# Altium project IGresupply.PrjPCB
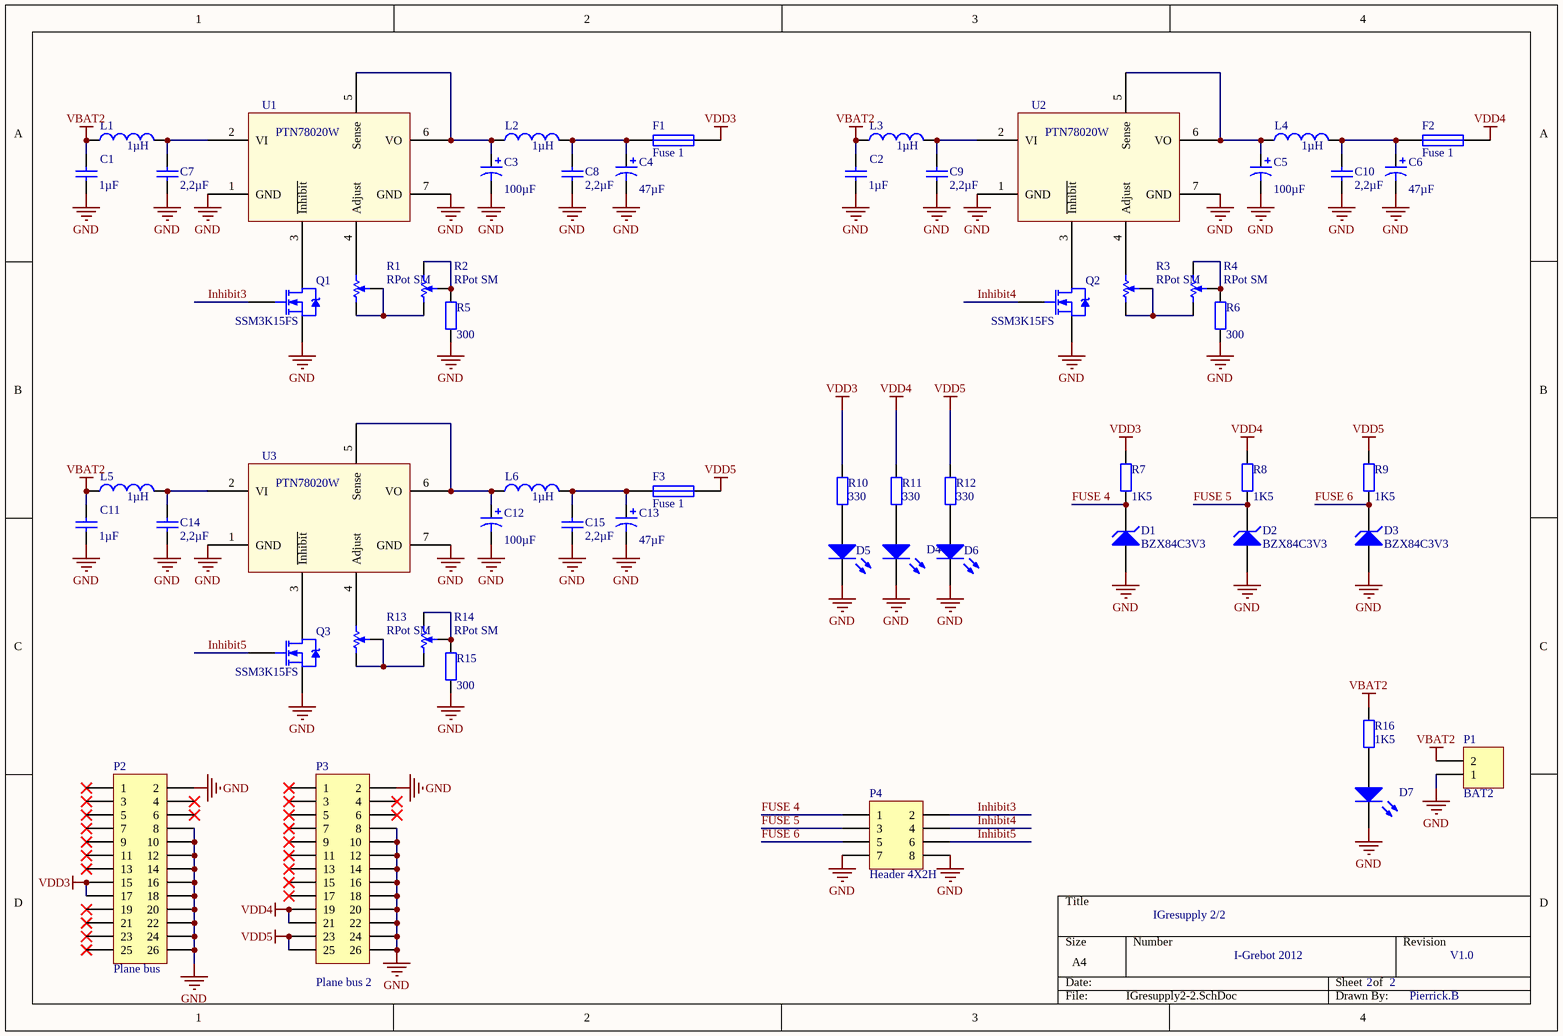
[diagram p0: IGresupply2-2.SchDoc]
2 sheets, 151 parts. Net scope: global (net labels, ports and power ports of the same name join across sheets).
Board file: IGresupply.PcbDoc
Sheets:
  IGresupply2-2.SchDoc
  IGresupply1-2.SchDoc

## Sheet IGresupply2-2.SchDoc
size A4

### Parts
C1  value 1µF  [Boitier tantale A]  (hidden comment: Cap)
C2  value 1µF  [Boitier tantale A]  (hidden comment: Cap)
C3  value 100µF  [Boitier tantale C]  (hidden comment: Cap Pol)
C4  value 47µF  [Boitier tantale C]  (hidden comment: Cap Pol)
C5  value 100µF  [Boitier tantale C]  (hidden comment: Cap Pol)
C6  value 47µF  [Boitier tantale C]  (hidden comment: Cap Pol)
C7  value 2,2µF  [Boitier tantale A]  (hidden comment: Cap)
C8  value 2,2µF  [Boitier tantale A]  (hidden comment: Cap)
C9  value 2,2µF  [Boitier tantale A]  (hidden comment: Cap)
C10  value 2,2µF  [Boitier tantale A]  (hidden comment: Cap)
C11  value 1µF  [Boitier tantale A]  (hidden comment: Cap)
C12  value 100µF  [Boitier tantale C]  (hidden comment: Cap Pol)
C13  value 47µF  [Boitier tantale C]  (hidden comment: Cap Pol)
C14  value 2,2µF  [Boitier tantale A]  (hidden comment: Cap)
C15  value 2,2µF  [Boitier tantale A]  (hidden comment: Cap)
D1  BZX84C3V3  [SOT-23]
D2  BZX84C3V3  [SOT-23]
D3  BZX84C3V3  [SOT-23]
D4  LED1  [HSMS-C110]  (value not drawn)
D5  LED1  [HSMS-C110]  (value not drawn)
D6  LED1  [HSMS-C110]  (value not drawn)
D7  LED1  [HSMS-C110]  (value not drawn)
F1  Fuse 1  [MCCQ-122]
F2  Fuse 1  [MCCQ-122]
F3  Fuse 1  [MCCQ-122]
L1  value 1µH  [744772010]  (hidden comment: Inductor)
L2  value 1µH  [744772010]  (hidden comment: Inductor)
L3  value 1µH  [744772010]  (hidden comment: Inductor)
L4  value 1µH  [744772010]  (hidden comment: Inductor)
L5  value 1µH  [744772010]  (hidden comment: Inductor)
L6  value 1µH  [744772010]  (hidden comment: Inductor)
P1  BAT2  [SL 5.08/90]
P2  Plane bus  [HDR2X13H]
P3  Plane bus 2  [HDR2X13H]
P4  Header 4X2H  [HDR2X4H]
Q1  SSM3K15FS  [SOT-23]
Q2  SSM3K15FS  [SOT-23]
Q3  SSM3K15FS  [SOT-23]
R1  RPot SM  [3296X]
R2  RPot SM  [3296X]
R3  RPot SM  [3296X]
R4  RPot SM  [3296X]
R5  value 300  [0805]  (hidden comment: Res2)
R6  value 300  [0805]  (hidden comment: Res2)
R7  value 1K5  [0805]  (hidden comment: Res2)
R8  value 1K5  [0805]  (hidden comment: Res2)
R9  value 1K5  [0805]  (hidden comment: Res2)
R10  value 330  [0805]  (hidden comment: Res2)
R11  value 330  [0805]  (hidden comment: Res2)
R12  value 330  [0805]  (hidden comment: Res2)
R13  RPot SM  [3296X]
R14  RPot SM  [3296X]
R15  value 300  [0805]  (hidden comment: Res2)
R16  value 1K5  [0805]  (hidden comment: Res2)
U1  PTN78020W  [EUK]
U2  PTN78020W  [EUK]
U3  PTN78020W  [EUK]

### Nets
GND: C1.1 C2.1 C3.2 C4.2 C5.2 C6.2 C7.1 C8.1 C9.1 C10.1 C11.1 C12.2 C13.2 C14.1 C15.1 D1.1(A) D2.1(A) D3.1(A) D4.2(K) D5.2(K) D6.2(K) D7.2(K) P1.1 P2.2 P2.8 P2.10 P2.12 P2.14 P2.16 P2.18 P2.20 P2.22 P2.24 P2.26 P3.2 P3.8 P3.10 P3.12 P3.14 P3.16 P3.18 P3.20 P3.22 P3.24 P3.26 P4.7 P4.8 Q1.3(S) Q2.3(S) Q3.3(S) R5.1 R6.1 R15.1 U1.1(GND) U1.7(GND) U2.1(GND) U2.7(GND) U3.1(GND) U3.7(GND)
VBAT2: C1.2 C2.2 C11.2 L1.1 L3.1 L5.1 P1.2 R16.2
VDD3: F1.2 P2.15 P2.17 R7.2 R10.2
VDD4: F2.2 P3.19 P3.21 R8.2 R11.2
VDD5: F3.2 P3.23 P3.25 R9.2 R12.2
FUSE 4: D1.3(K) P4.1 R7.1
FUSE 5: D2.3(K) P4.3 R8.1
FUSE 6: D3.3(K) P4.5 R9.1
Inhibit3: P4.2 Q1.1(G)
Inhibit4: P4.4 Q2.1(G)
Inhibit5: P4.6 Q3.1(G)
NetC3_1: C3.1 L2.1 U1.5(Sense) U1.6(VO)
NetC4_1: C4.1 C8.2 F1.1 L2.2
NetC5_1: C5.1 L4.1 U2.5(Sense) U2.6(VO)
NetC6_1: C6.1 C10.2 F2.1 L4.2
NetC7_2: C7.2 L1.2 U1.2(VI)
NetC9_2: C9.2 L3.2 U2.2(VI)
NetC12_1: C12.1 L6.1 U3.5(Sense) U3.6(VO)
NetC13_1: C13.1 C15.2 F3.1 L6.2
NetC14_2: C14.2 L5.2 U3.2(VI)
NetD4_1: D4.1(A) R11.1
NetD5_1: D5.1(A) R10.1
NetD6_1: D6.1(A) R12.1
NetD7_1: D7.1(A) R16.1
NetQ1_2: Q1.2(D) U1.3(~{Inhibit})
NetQ2_2: Q2.2(D) U2.3(~{Inhibit})
NetQ3_2: Q3.2(D) U3.3(~{Inhibit})
NetR1_1: R1.1(-) R1.2(W) R2.1(-)
NetR1_3: R1.3(+) U1.4(Adjust)
NetR2_2: R2.2(W) R2.3(+) R5.2
NetR3_1: R3.1(-) R3.2(W) R4.1(-)
NetR3_3: R3.3(+) U2.4(Adjust)
NetR4_2: R4.2(W) R4.3(+) R6.2
NetR13_1: R13.1(-) R13.2(W) R14.1(-)
NetR13_3: R13.3(+) U3.4(Adjust)
NetR14_2: R14.2(W) R14.3(+) R15.2

Not connected (* = marked no-connect by the designer): P2 1* 3* 4* 5* 6* 7* 9* 11* 13* 19* 21* 23* 25*; P3 1* 3* 4* 5* 6* 7* 9* 11* 13* 15* 17*

### Notes on the sheet
- IGresupply 2/2
- I-Grebot 2012
- 2
- V1.0
- Pierrick.B

### Library data of the parts
C1 C2 C7-C11 C14 C15 = Cap: Capacitor; Published: 8-Jun-2000; LatestRevisionDate: 17-Jul-2002; LatestRevisionNote: Re-released for DXP Platform.; PackageReference: RAD-0.3; Publisher: Altium Limited; Supplier: FARNELL
C3-C6 C12 C13 = Cap Pol: Polarized Capacitor; Published: 8-Jun-2000; LatestRevisionDate: 17-Jul-2002; LatestRevisionNote: Re-released for DXP Platform.; PackageReference: POLAR0.8; Publisher: Altium Limited; Supplier: FARNELL
D1-D3 = D Zener: Zener Diode; Published: 8-Jun-2000; LatestRevisionDate: 17-Jul-2002; LatestRevisionNote: Re-released for DXP Platform.; PackageReference: DIODE-0.7; Publisher: Altium Limited
D4-D7 = LED1: Typical RED GaAs LED; Published: 8-Jun-2000; LatestRevisionDate: 08-Jul-2005; LatestRevisionNote: Mech Layer 1 removed.; PackageReference: LED-1; Publisher: Altium Limited
F1-F3 = Fuse 1: Fuse; Published: 8-Jun-2000; LatestRevisionDate: 17-Jul-2002; LatestRevisionNote: Re-released for DXP Platform.; PackageReference: PIN-W2/E2.8; Publisher: Altium Limited
L1-L6 = Inductor: Code_IEC: 1005; Published: 8-Jun-2000; LatestRevisionDate: 17-Jul-2002; LatestRevisionNote: Re-released for DXP Platform.; PackageReference: 0402-A; Publisher: Altium Limited; Code_JEITA: 0402
P1 = 0436500203: Micro-Fit, 3.0; LatestRevisionDate: 17-Jul-2002; LatestRevisionNote: Re-released for DXP Platform.; Publisher: Altium Limited
P2 P3 = Header 13X2H: Header, 13-Pin, Dual row, Right Angle; LatestRevisionDate: 17-Jul-2002; LatestRevisionNote: Re-released for DXP Platform.; Publisher: Altium Limited
P4 = Header 4X2H: Header, 4-Pin, Dual row, Right Angle; LatestRevisionDate: 17-Jul-2002; LatestRevisionNote: Re-released for DXP Platform.; Publisher: Altium Limited
Q1-Q3 = NMOS-2: N-Channel Power MOSFET; Note: Pin 2 is electrically connected to pin 4.; Published: 8-Jun-2000; LatestRevisionDate: 17-Jul-2002; LatestRevisionNote: Re-released for DXP Platform.; DatasheetDocument: PD-9.814; PackageReference: TO-220AB; Publisher: Altium Limited; Code_JEDEC: TO-220-AB; ComponentLink1Description: Manufacturer Link; ComponentLink1URL: http://www.irf.com/
R1-R4 R13 R14 = RPot SM: Square Trimming Potentiometer; Published: 17-Dec-2003; DatasheetDocument: Oct-2003; PackageReference: POT4MM-2; Publisher: Altium Limited; ComponentLink1Description: Manufacturer Link; ComponentLink1URL: http://bourns.com/2/search.html
R5-R12 R15 R16 = Res2: Resistor; Published: 8-Jun-2000; LatestRevisionDate: 17-Jul-2002; LatestRevisionNote: Re-released for DXP Platform.; PackageReference: AXIAL-0.4; Publisher: Altium Limited
  R5-R9 R15: Supplier: FARNELL

## Sheet IGresupply1-2.SchDoc
size A3
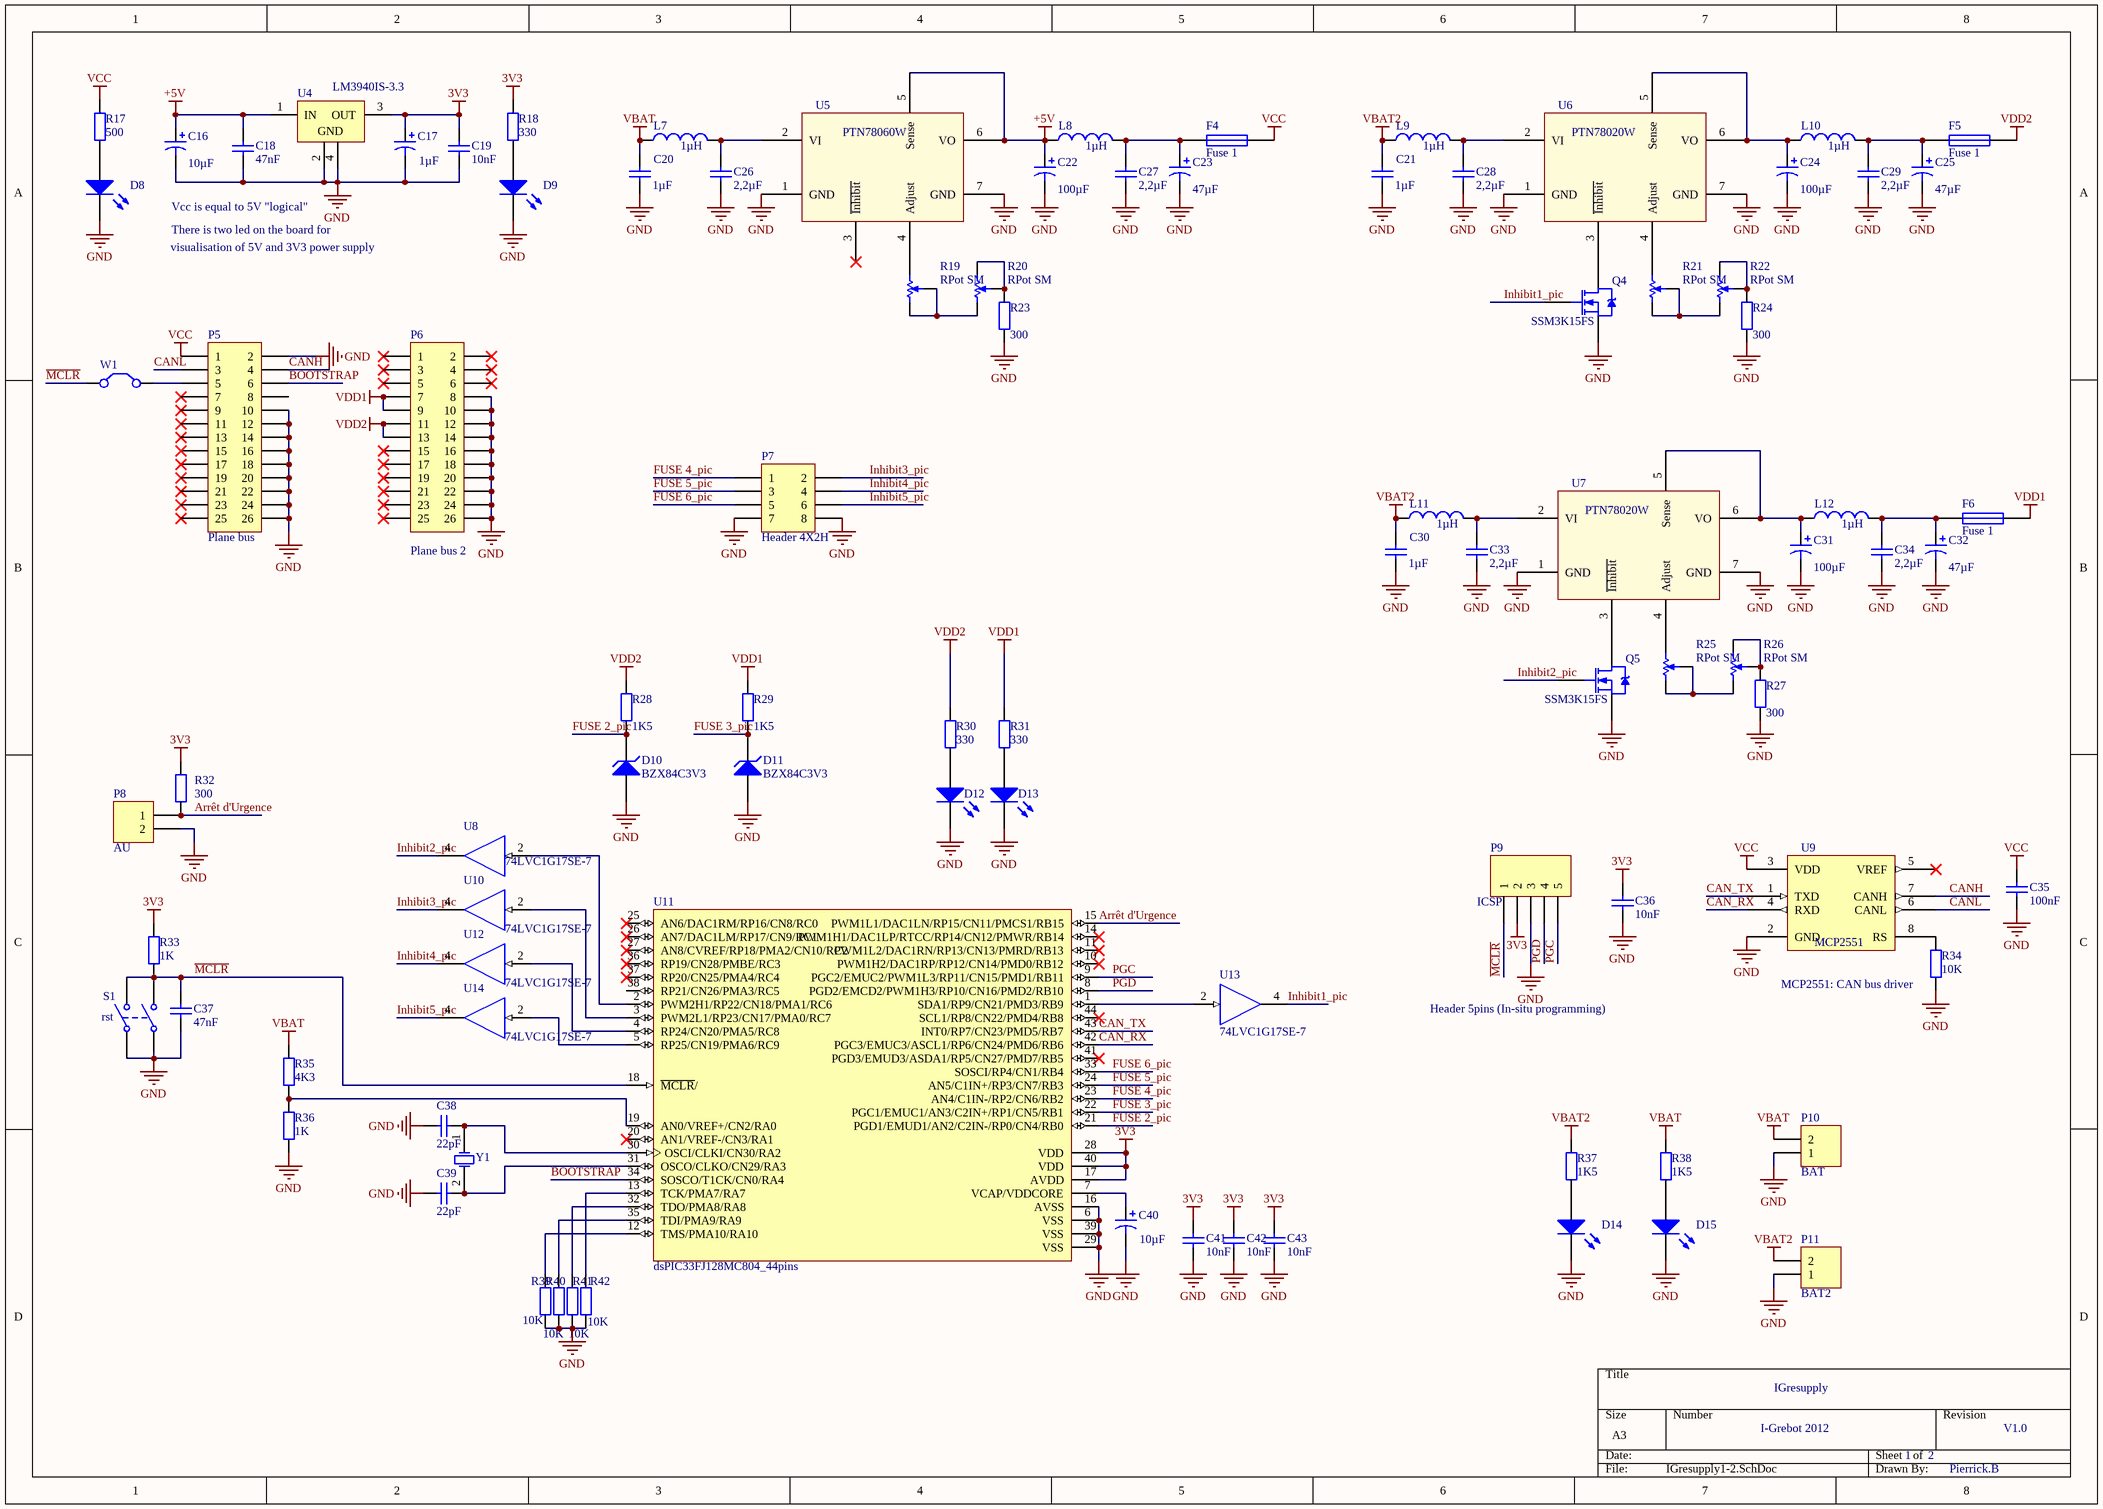
[diagram p1: IGresupply1-2.SchDoc]

### Parts
C16  value 10µF  [Boitier tantale A]  (hidden comment: Cap Pol)
C17  value 1µF  [Boitier tantale A]  (hidden comment: Cap Pol)
C18  value 47nF  [C0603]  (hidden comment: Cap)
C19  value 10nF  [C0603]  (hidden comment: Cap)
C20  value 1µF  [Boitier tantale A]  (hidden comment: Cap)
C21  value 1µF  [Boitier tantale A]  (hidden comment: Cap)
C22  value 100µF  [Boitier tantale C]  (hidden comment: Cap Pol)
C23  value 47µF  [Boitier tantale C]  (hidden comment: Cap Pol)
C24  value 100µF  [Boitier tantale C]  (hidden comment: Cap Pol)
C25  value 47µF  [Boitier tantale C]  (hidden comment: Cap Pol)
C26  value 2,2µF  [Boitier tantale A]  (hidden comment: Cap)
C27  value 2,2µF  [Boitier tantale A]  (hidden comment: Cap)
C28  value 2,2µF  [Boitier tantale A]  (hidden comment: Cap)
C29  value 2,2µF  [Boitier tantale A]  (hidden comment: Cap)
C30  value 1µF  [Boitier tantale A]  (hidden comment: Cap)
C31  value 100µF  [Boitier tantale C]  (hidden comment: Cap Pol)
C32  value 47µF  [Boitier tantale C]  (hidden comment: Cap Pol)
C33  value 2,2µF  [Boitier tantale A]  (hidden comment: Cap)
C34  value 2,2µF  [Boitier tantale A]  (hidden comment: Cap)
C35  value 100nF  [C0603]  (hidden comment: Cap)
C36  value 10nF  [C0603]  (hidden comment: Cap)
C37  value 47nF  [C0603]  (hidden comment: Cap)
C38  value 22pF  [C0603]  (hidden comment: Cap)
C39  value 22pF  [C0603]  (hidden comment: Cap)
C40  value 10µF  [Boitier tantale A]  (hidden comment: Cap Pol)
C41  value 10nF  [C0603]  (hidden comment: Cap)
C42  value 10nF  [C0603]  (hidden comment: Cap)
C43  value 10nF  [C0603]  (hidden comment: Cap)
D8  LED1  [HSMS-C110]  (value not drawn)
D9  LED1  [HSMS-C110]  (value not drawn)
D10  BZX84C3V3  [SOT-23]
D11  BZX84C3V3  [SOT-23]
D12  LED1  [HSMS-C110]  (value not drawn)
D13  LED1  [HSMS-C110]  (value not drawn)
D14  LED1  [HSMS-C110]  (value not drawn)
D15  LED1  [HSMS-C110]  (value not drawn)
F4  Fuse 1  [MCCQ-122]
F5  Fuse 1  [MCCQ-122]
F6  Fuse 1  [MCCQ-122]
L7  value 1µH  [744772010]  (hidden comment: Inductor)
L8  value 1µH  [744772010]  (hidden comment: Inductor)
L9  value 1µH  [744772010]  (hidden comment: Inductor)
L10  value 1µH  [744772010]  (hidden comment: Inductor)
L11  value 1µH  [744772010]  (hidden comment: Inductor)
L12  value 1µH  [744772010]  (hidden comment: Inductor)
P5  Plane bus  [HDR2X13H]
P6  Plane bus 2  [HDR2X13H]
P7  Header 4X2H  [HDR2X4H]
P8  AU  [SL 5.08/90]
P9  ICSP  [HDR1X5]
P10  BAT  [SL 5.08/90]
P11  BAT2  [SL 5.08/90]
Q4  SSM3K15FS  [SOT-23]
Q5  SSM3K15FS  [SOT-23]
R17  value 500  [0805]  (hidden comment: Res2)
R18  value 330  [0805]  (hidden comment: Res2)
R19  RPot SM  [3296X]
R20  RPot SM  [3296X]
R21  RPot SM  [3296X]
R22  RPot SM  [3296X]
R23  value 300  [0805]  (hidden comment: Res2)
R24  value 300  [0805]  (hidden comment: Res2)
R25  RPot SM  [3296X]
R26  RPot SM  [3296X]
R27  value 300  [0805]  (hidden comment: Res2)
R28  value 1K5  [0805]  (hidden comment: Res2)
R29  value 1K5  [0805]  (hidden comment: Res2)
R30  value 330  [0805]  (hidden comment: Res2)
R31  value 330  [0805]  (hidden comment: Res2)
R32  value 300  [0603]  (hidden comment: Res2)
R33  value 1K  [0603]  (hidden comment: Res2)
R34  value 10K  [0805]  (hidden comment: Res2)
R35  value 4K3  [0603]  (hidden comment: Res2)
R36  value 1K  [0603]  (hidden comment: Res2)
R37  value 1K5  [0805]  (hidden comment: Res2)
R38  value 1K5  [0805]  (hidden comment: Res2)
R39  value 10K  [0603]  (hidden comment: Res2)
R40  value 10K  [0603]  (hidden comment: Res2)
R41  value 10K  [0603]  (hidden comment: Res2)
R42  value 10K  [0603]  (hidden comment: Res2)
S1  rst  [Bouton poussoir]
U4  LM3940IS-3.3  [SOT223]
U5  PTN78060W  [EUW]
U6  PTN78020W  [EUK]
U7  PTN78020W  [EUK]
U8  74LVC1G17SE-7  [DBV]
U9  MCP2551  [SOIC150-8]
U10  74LVC1G17SE-7  [DBV]
U11  dsPIC33FJ128MC804_44pins  [TQFP-44]
U12  74LVC1G17SE-7  [DBV]
U13  74LVC1G17SE-7  [DBV]
U14  74LVC1G17SE-7  [DBV]
W1  Jumper  [HDR1X2]  (value not drawn)
Y1  XTAL  [HC49US]  (value not drawn)

### Nets
3V3: C17.1 C19.2 C36.2 C41.2 C42.2 C43.2 P9.2 R18.2 R32.2 R33.2 U4.3(OUT) U11.17(AVDD) U11.28(VDD) U11.40(VDD)
+5V: C16.1 C18.2 C22.1 L8.1 U4.1(IN) U5.5(Sense) U5.6(VO) U8.5(+5V) U10.5(+5V) U12.5(+5V) U13.5(+5V) U14.5(+5V)
GND: C16.2 C17.2 C18.1 C19.1 C20.1 C21.1 C22.2 C23.2 C24.2 C25.2 C26.1 C27.1 C28.1 C29.1 C30.1 C31.2 C32.2 C33.1 C34.1 C35.1 C36.1 C37.1 C38.1 C39.1 C40.2 C41.1 C42.1 C43.1 D8.2(K) D9.2(K) D10.1(A) D11.1(A) D12.2(K) D13.2(K) D14.2(K) D15.2(K) P5.2 P5.10 P5.12 P5.14 P5.16 P5.18 P5.20 P5.22 P5.24 P5.26 P6.8 P6.10 P6.12 P6.14 P6.16 P6.18 P6.20 P6.22 P6.24 P6.26 P7.7 P7.8 P8.2 P9.3 P10.1 P11.1 Q4.3(S) Q5.3(S) R23.1 R24.1 R27.1 R34.1 R36.1 R39.1 R40.1 R41.1 R42.1 S1.1(COMMON1) S1.3(COMMON2) U4.2(GND) U4.4(GND) U5.1(GND) U5.7(GND) U6.1(GND) U6.7(GND) U7.1(GND) U7.7(GND) U8.3(GND) U9.2(GND) U10.3(GND) U11.6(VSS) U11.16(AVSS) U11.29(VSS) U11.39(VSS) U12.3(GND) U13.3(GND) U14.3(GND)
VBAT: C20.2 L7.1 P10.2 R35.2 R38.2
VBAT2: C21.2 C30.2 L9.1 L11.1 P11.2 R37.2
VCC: C35.2 F4.2 P5.1 R17.2 U9.3(VDD)
VDD1: F6.2 P6.7 P6.9 R29.2 R31.2
VDD2: F5.2 P6.11 P6.13 R28.2 R30.2
Arrêt d'Urgence: P8.1 R32.1 U11.15(PWM1L1/DAC1LN/RP15/CN11/PMCS1/RB15)
BOOTSTRAP: P5.6 U11.34(SOSCO/T1CK/CN0/RA4)
CAN_RX: U9.4(RXD) U11.42(PGC3/EMUC3/ASCL1/RP6/CN24/PMD6/RB6)
CAN_TX: U9.1(TXD) U11.43(INT0/RP7/CN23/PMD5/RB7)
CANH: P5.4 U9.7(CANH)
CANL: P5.3 U9.6(CANL)
FUSE 2_pic: D10.3(K) R28.1 U11.21(PGD1/EMUD1/AN2/C2IN-/RP0/CN4/RB0)
FUSE 3_pic: D11.3(K) R29.1 U11.22(PGC1/EMUC1/AN3/C2IN+/RP1/CN5/RB1)
FUSE 4_pic: P7.1 U11.23(AN4/C1IN-/RP2/CN6/RB2)
FUSE 5_pic: P7.3 U11.24(AN5/C1IN+/RP3/CN7/RB3)
FUSE 6_pic: P7.5 U11.33(SOSCI/RP4/CN1/RB4)
Inhibit1_pic: Q4.1(G) U13.4(Y)
Inhibit2_pic: Q5.1(G) U8.4(Y)
Inhibit3_pic: P7.2 U10.4(Y)
Inhibit4_pic: P7.4 U12.4(Y)
Inhibit5_pic: P7.6 U14.4(Y)
~{MCLR}: C37.2 P9.1 R33.1 S1.2(NO1) S1.4(NO2) U11.18(~{MCLR}/) W1.1(C1)
PGC: P9.5 U11.9(PGC2/EMUC2/PWM1L3/RP11/CN15/PMD1/RB11)
PGD: P9.4 U11.8(PGD2/EMCD2/PWM1H3/RP10/CN16/PMD2/RB10)
NetC23_1: C23.1 C27.2 F4.1 L8.2
NetC24_1: C24.1 L10.1 U6.5(Sense) U6.6(VO)
NetC25_1: C25.1 C29.2 F5.1 L10.2
NetC26_2: C26.2 L7.2 U5.2(VI)
NetC28_2: C28.2 L9.2 U6.2(VI)
NetC31_1: C31.1 L12.1 U7.5(Sense) U7.6(VO)
NetC32_1: C32.1 C34.2 F6.1 L12.2
NetC33_2: C33.2 L11.2 U7.2(VI)
NetC38_2: C38.2 U11.30(OSCI/CLKI/CN30/RA2) Y1.1(OSC1)
NetC39_2: C39.2 U11.31(OSCO/CLKO/CN29/RA3) Y1.2(OSC2)
NetC40_1: C40.1 U11.7(VCAP/VDDCORE)
NetD8_1: D8.1(A) R17.1
NetD9_1: D9.1(A) R18.1
NetD12_1: D12.1(A) R30.1
NetD13_1: D13.1(A) R31.1
NetD14_1: D14.1(A) R37.1
NetD15_1: D15.1(A) R38.1
NetP5_5: P5.5 W1.2(C2)
NetQ4_2: Q4.2(D) U6.3(~{Inhibit})
NetQ5_2: Q5.2(D) U7.3(~{Inhibit})
NetR19_1: R19.1(-) R19.2(W) R20.1(-)
NetR19_3: R19.3(+) U5.4(Adjust)
NetR20_2: R20.2(W) R20.3(+) R23.2
NetR21_1: R21.1(-) R21.2(W) R22.1(-)
NetR21_3: R21.3(+) U6.4(Adjust)
NetR22_2: R22.2(W) R22.3(+) R24.2
NetR25_1: R25.1(-) R25.2(W) R26.1(-)
NetR25_3: R25.3(+) U7.4(Adjust)
NetR26_2: R26.2(W) R26.3(+) R27.2
NetR34_2: R34.2 U9.8(RS)
NetR35_1: R35.1 R36.2 U11.19(AN0/VREF+/CN2/RA0)
NetR39_2: R39.2 U11.12(TMS/PMA10/RA10)
NetR40_2: R40.2 U11.35(TDI/PMA9/RA9)
NetR41_2: R41.2 U11.32(TDO/PMA8/RA8)
NetR42_2: R42.2 U11.13(TCK/PMA7/RA7)
NetU8_2: U8.2(A) U11.2(PWM2H1/RP22/CN18/PMA1/RC6)
NetU10_2: U10.2(A) U11.3(PWM2L1/RP23/CN17/PMA0/RC7)
NetU11_1: U11.1(SDA1/RP9/CN21/PMD3/RB9) U13.2(A)
NetU11_4: U11.4(RP24/CN20/PMA5/RC8) U12.2(A)
NetU11_5: U11.5(RP25/CN19/PMA6/RC9) U14.2(A)

Not connected (* = marked no-connect by the designer): P5 7* 8 9* 11* 13* 15* 17* 19* 21* 23* 25*; P6 1* 2* 3* 4* 5* 6* 15* 17* 19* 21* 23* 25*; U5 3(~{Inhibit})*; U9 5(VREF)*; U11 10(PWM1H2/DAC1RP/RP12/CN14/PMD0/RB12)* 11(PWM1L2/DAC1RN/RP13/CN13/PMRD/RB13)* 14(PWM1H1/DAC1LP/RTCC/RP14/CN12/PMWR/RB14)* 20(AN1/VREF-/CN3/RA1)* 25(AN6/DAC1RM/RP16/CN8/RC0)* 26(AN7/DAC1LM/RP17/CN9/RC1)* 27(AN8/CVREF/RP18/PMA2/CN10/RC2)* 36(RP19/CN28/PMBE/RC3)* 37(RP20/CN25/PMA4/RC4)* 38(RP21/CN26/PMA3/RC5) 41(PGD3/EMUD3/ASDA1/RP5/CN27/PMD7/RB5)* 44(SCL1/RP8/CN22/PMD4/RB8)*

### Notes on the sheet
- Vcc is equal to 5V "logical"
- There is two led on the board for
- visualisation of 5V and 3V3 power supply
- (near R34) MCP2551: CAN bus driver
- Header 5pins (In-situ programming)
- IGresupply
- I-Grebot 2012
- 1
- 2
- V1.0
- Pierrick.B

### Library data of the parts
C16 C17 C22-C25 C31 C32 C40 = Cap Pol: Polarized Capacitor; Published: 8-Jun-2000; LatestRevisionDate: 17-Jul-2002; LatestRevisionNote: Re-released for DXP Platform.; PackageReference: POLAR0.8; Publisher: Altium Limited
  C22-C25 C31 C32: Supplier: FARNELL
C18-C21 C26-C30 C33-C39 C41-C43 = Cap: Capacitor; Published: 8-Jun-2000; LatestRevisionDate: 17-Jul-2002; LatestRevisionNote: Re-released for DXP Platform.; PackageReference: RAD-0.3; Publisher: Altium Limited
  C20 C21 C26-C30 C33 C34: Supplier: FARNELL
D8 D9 D12-D15 = LED1: Typical RED GaAs LED; Published: 8-Jun-2000; LatestRevisionDate: 08-Jul-2005; LatestRevisionNote: Mech Layer 1 removed.; PackageReference: LED-1; Publisher: Altium Limited
D10 D11 = D Zener: Zener Diode; Published: 8-Jun-2000; LatestRevisionDate: 17-Jul-2002; LatestRevisionNote: Re-released for DXP Platform.; PackageReference: DIODE-0.7; Publisher: Altium Limited
F4-F6 = Fuse 1: Fuse; Published: 8-Jun-2000; LatestRevisionDate: 17-Jul-2002; LatestRevisionNote: Re-released for DXP Platform.; PackageReference: PIN-W2/E2.8; Publisher: Altium Limited
L7-L12 = Inductor: Code_IEC: 1005; Published: 8-Jun-2000; LatestRevisionDate: 17-Jul-2002; LatestRevisionNote: Re-released for DXP Platform.; PackageReference: 0402-A; Publisher: Altium Limited; Code_JEITA: 0402
P5 P6 = Header 13X2H: Header, 13-Pin, Dual row, Right Angle; LatestRevisionDate: 17-Jul-2002; LatestRevisionNote: Re-released for DXP Platform.; Publisher: Altium Limited
P7 = Header 4X2H: Header, 4-Pin, Dual row, Right Angle; LatestRevisionDate: 17-Jul-2002; LatestRevisionNote: Re-released for DXP Platform.; Publisher: Altium Limited
P8 P10 P11 = 0436500203: Micro-Fit, 3.0; LatestRevisionDate: 17-Jul-2002; LatestRevisionNote: Re-released for DXP Platform.; Publisher: Altium Limited
P9 = Header 5: Header, 5-Pin; LatestRevisionDate: 17-Jul-2002; LatestRevisionNote: Re-released for DXP Platform.; Publisher: Altium Limited
Q4 Q5 = NMOS-2: as Q1 on sheet IGresupply2-2; Published: 8-Jun-2000; LatestRevisionDate: 17-Jul-2002; LatestRevisionNote: Re-released for DXP Platform.; DatasheetDocument: PD-9.814; PackageReference: TO-220AB; Publisher: Altium Limited; Code_JEDEC: TO-220-AB; ComponentLink1Description: Manufacturer Link; ComponentLink1URL: http://www.irf.com/
R17 R18 R23 R24 R27-R42 = Res2: Resistor; Published: 8-Jun-2000; LatestRevisionDate: 17-Jul-2002; LatestRevisionNote: Re-released for DXP Platform.; PackageReference: AXIAL-0.4; Publisher: Altium Limited
  R23 R24 R27-R29 R32: Supplier: FARNELL
R19-R22 R25 R26 = RPot SM: Square Trimming Potentiometer; Published: 17-Dec-2003; DatasheetDocument: Oct-2003; PackageReference: POT4MM-2; Publisher: Altium Limited; ComponentLink1Description: Manufacturer Link; ComponentLink1URL: http://bourns.com/2/search.html
S1 = SW-DPST: Double-Pole, Single-Throw Switch; Published: 24-Mar-1999; LatestRevisionDate: 17-Jul-2002; LatestRevisionNote: Re-released for DXP Platform.; PackageReference: DPST-4; Publisher: Altium Limited
U4 = LM3940IS-3.3: 1A Low-Dropout Regulator For 5V to 3.3V Conversion; Note: Tab is connected to GND; Published: 15-Apr-2002; DatasheetDocument: Apr-1998; PackageReference: TS3B; Publisher: Altium Limited; ComponentLink1Description: Manufacturer Link; ComponentLink1URL: http://www.national.com/; ComponentLink2Description: Datasheet; ComponentLink2URL: http://www.national.com/ds.cgi/LM/LM3940.pdf; ComponentLink3Description: URL Link1; ComponentLink3URL: http://www.national.com/pf/LM/LM3940.html
U8 U10 U12-U14 = 74LVC1G17SE-7: SINGLE BUS BUFFER GATE  WITH 3-STATE OUTPUT; PackageDocument: 2000; Published: 15-Apr-2002; LatestRevisionDate: 06-Jun-2005; LatestRevisionNote: Stylized 3D Model Added.; DatasheetDocument: Jun-1989; PackageReference: N14A; Publisher: Altium Limited; ComponentLink1Description: Manufacturer Link; ComponentLink1URL: http://www.national.com/; ComponentLink2Description: Datasheet; ComponentLink2URL: http://www.national.com/ds.cgi/DM/DM54125.pdf; ComponentLink3Description: URL Link1; ComponentLink3URL: http://www.national.com/pf/DM/DM54125.html
U9 = MCP2551: High Speed Can Transceiver; Published: 6-Oct-2005; DatasheetDocument: Nov-2003; PackageDocument: Oct-2005; PackageReference: SOIC150-8; Publisher: Altium Limited; Code_JEDEC: MS-012; ComponentLink1Description: Manufacturer Link; ComponentLink1URL: http://www.microchip.com; ComponentLink2Description: Datasheet; ComponentLink2URL: http://ww1.microchip.com/downloads/en/DeviceDoc/21667d.pdf
W1 = Jumper: Jumper Wire; Published: 24-Mar-1999; LatestRevisionDate: 17-Jul-2002; LatestRevisionNote: Re-released for DXP Platform.; PackageReference: RAD-0.2; Publisher: Altium Limited; PackageDescription: Radial Cap, Thru-Hole; 2 Leads; 0.2 in Pin Spacing
Y1 = XTAL: Crystal Oscillator; Published: 8-Jun-2000; LatestRevisionDate: 17-Jul-2002; LatestRevisionNote: Re-released for DXP Platform.; PackageReference: R38; Publisher: Altium Limited
U11 = dsPIC33FJ128MC804_44pins: LatestRevisionDate: 10-Feb-2009; PackageReference: TQFP-44; Supplier name: FARNELL; Supplier code: *

## Nets that join several sheets
GND: IGresupply2-2 (59 pins), IGresupply1-2 (93 pins)
VBAT2: IGresupply2-2 (8 pins), IGresupply1-2 (6 pins)